# Altium project bt-bezel-pvt1.PrjPcb
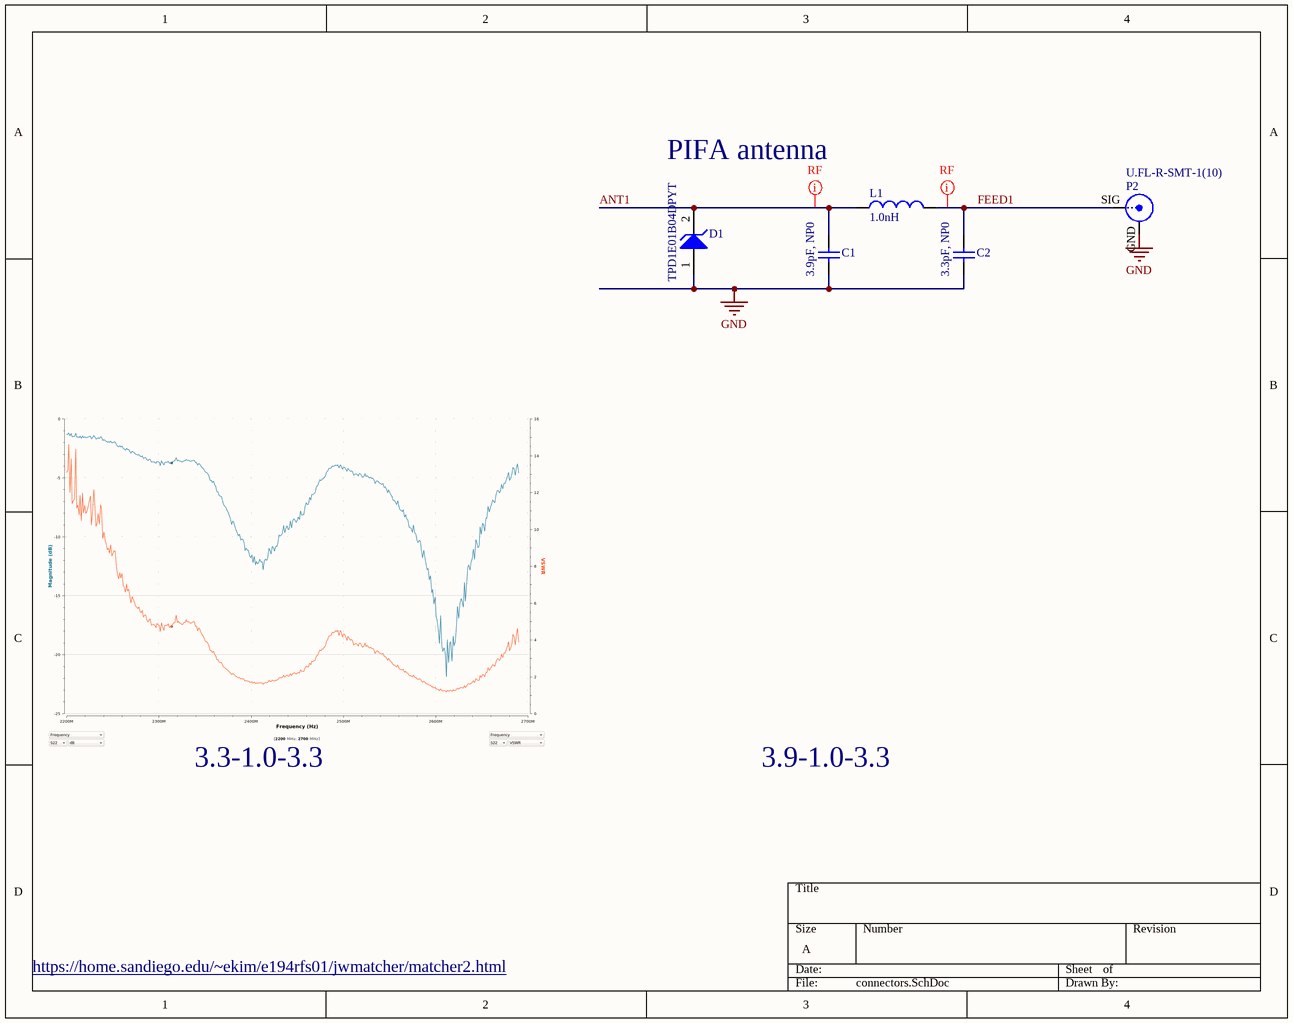
[diagram p0: connectors.SchDoc]
1 sheet, 5 parts. Net scope: global (net labels, ports and power ports of the same name join across sheets).
Board files: bt-bezel-pvt2a_final_mp.PcbDoc, bt-bezel-pvt2a_final_fern.PcbDoc, bt-bezel-pvt2a_final_braille.PcbDoc

## Sheet connectors.SchDoc
size A

### Parts
C1  3.9pF, NP0  [B_CAP0402]
C2  3.3pF, NP0  [B_CAP0402]
D1  TPD1E01B04DPYT  [TI_PX1SON-N2]
L1  1.0nH  [B_IND0402]
P2  U.FL-R-SMT-1(10)  [HRS_U.FL]

### Nets
GND: C1.2 C2.2 D1.1(A) P2.GND(Y)
ANT1: C1.1 D1.2(K) L1.1
FEED1: C2.1 L1.2 P2.SIG(X)

### Layout directives
net class RF: ANT1, FEED1

### Notes on the sheet
- PIFA antenna
- 3.3-1.0-3.3
- 3.9-1.0-3.3
- https://home.sandiego.edu/~ekim/e194rfs01/jwmatcher/matcher2.html

### Library data of the parts
C1 = Cap Semi: Capacitor (Semiconductor SIM Model); MPN: CL05C3R9CB5NNNC; VENDOR: Samsung; MYPN: C-3p9-50-NP0-0402
C2 = Cap Semi: Capacitor (Semiconductor SIM Model); MPN: GRM1555C1H3R3CA01D; VENDOR: Murata; MYPN: C-3p3-50-NP0-0402
D1 = D Zener: CPDUR24V; VENDOR: TI; MYPN: D-TPD1E01B04DPYT; Published: 8-Jun-2000; LatestRevisionDate: 17-Jul-2002; LatestRevisionNote: Re-released for DXP Platform.; PackageReference: DIODE-0.7; Publisher: Altium Limited; PackageDescription: Diode, Thru-Hole; 2 Leads; 0.7 in Pin Spacing; MPN: TPD1E01B04DPYT
L1 = Inductor: MPN: LQG15HS1N0S02D; Code_IEC: 1005; VENDOR: Murata; MYPN: L-1p0NH-0402; Published: 8-Jun-2000; LatestRevisionDate: 29-May-2009; LatestRevisionNote: IPC-7351 Footprint Added.; PackageReference: 0402-A; Publisher: Altium Limited; PackageDescription: Chip Inductor; Code_JEITA: 0402
P2 = BNC: BNC Elbow Connector; MPN: P1163-0140R; VENDOR: Kaweei; MYPN: J-U.FL-SMT; LatestRevisionDate: 17-Jul-2002; LatestRevisionNote: Re-released for DXP Platform.; Publisher: Altium Limited